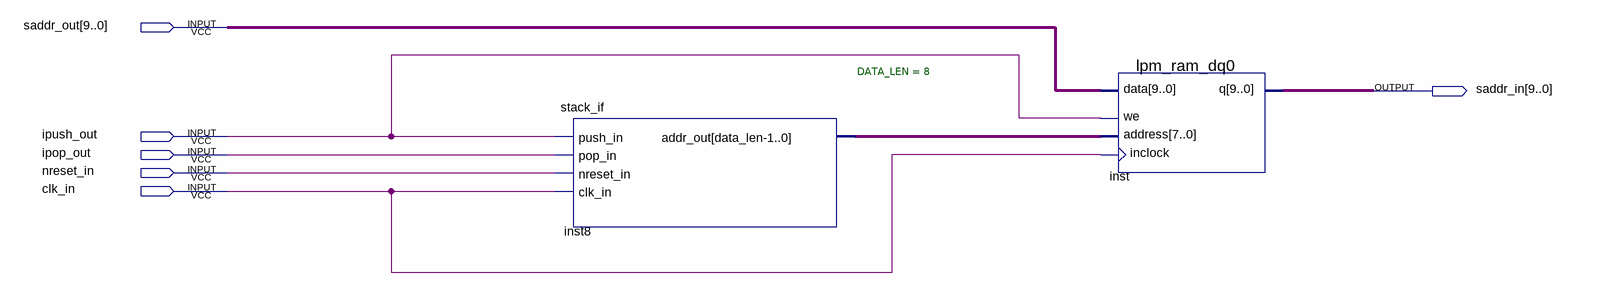
[diagram p0: schematic sheet]
// Quartus schematic stack.bdf as structural Verilog: 2 symbols, 6 pins
module stack (
  input  [9:0] saddr_out,
  input  ipush_out,
  input  ipop_out,
  input  nreset_in,
  input  clk_in,
  output [9:0] saddr_in
);

  wire [7:0] inst8_addr_out;

  stack_if #(.DATA_LEN(8)) inst8 (
    .push_in(ipush_out), .pop_in(ipop_out), .nreset_in(nreset_in), .clk_in(clk_in), .addr_out(inst8_addr_out));
  lpm_ram_dq0 inst (.data(saddr_out), .we(ipush_out), .address(inst8_addr_out), .inclock(clk_in), .q(saddr_in));
endmodule
